# EAGLE design R2P_BLDC_module (EAGLE 6.4)
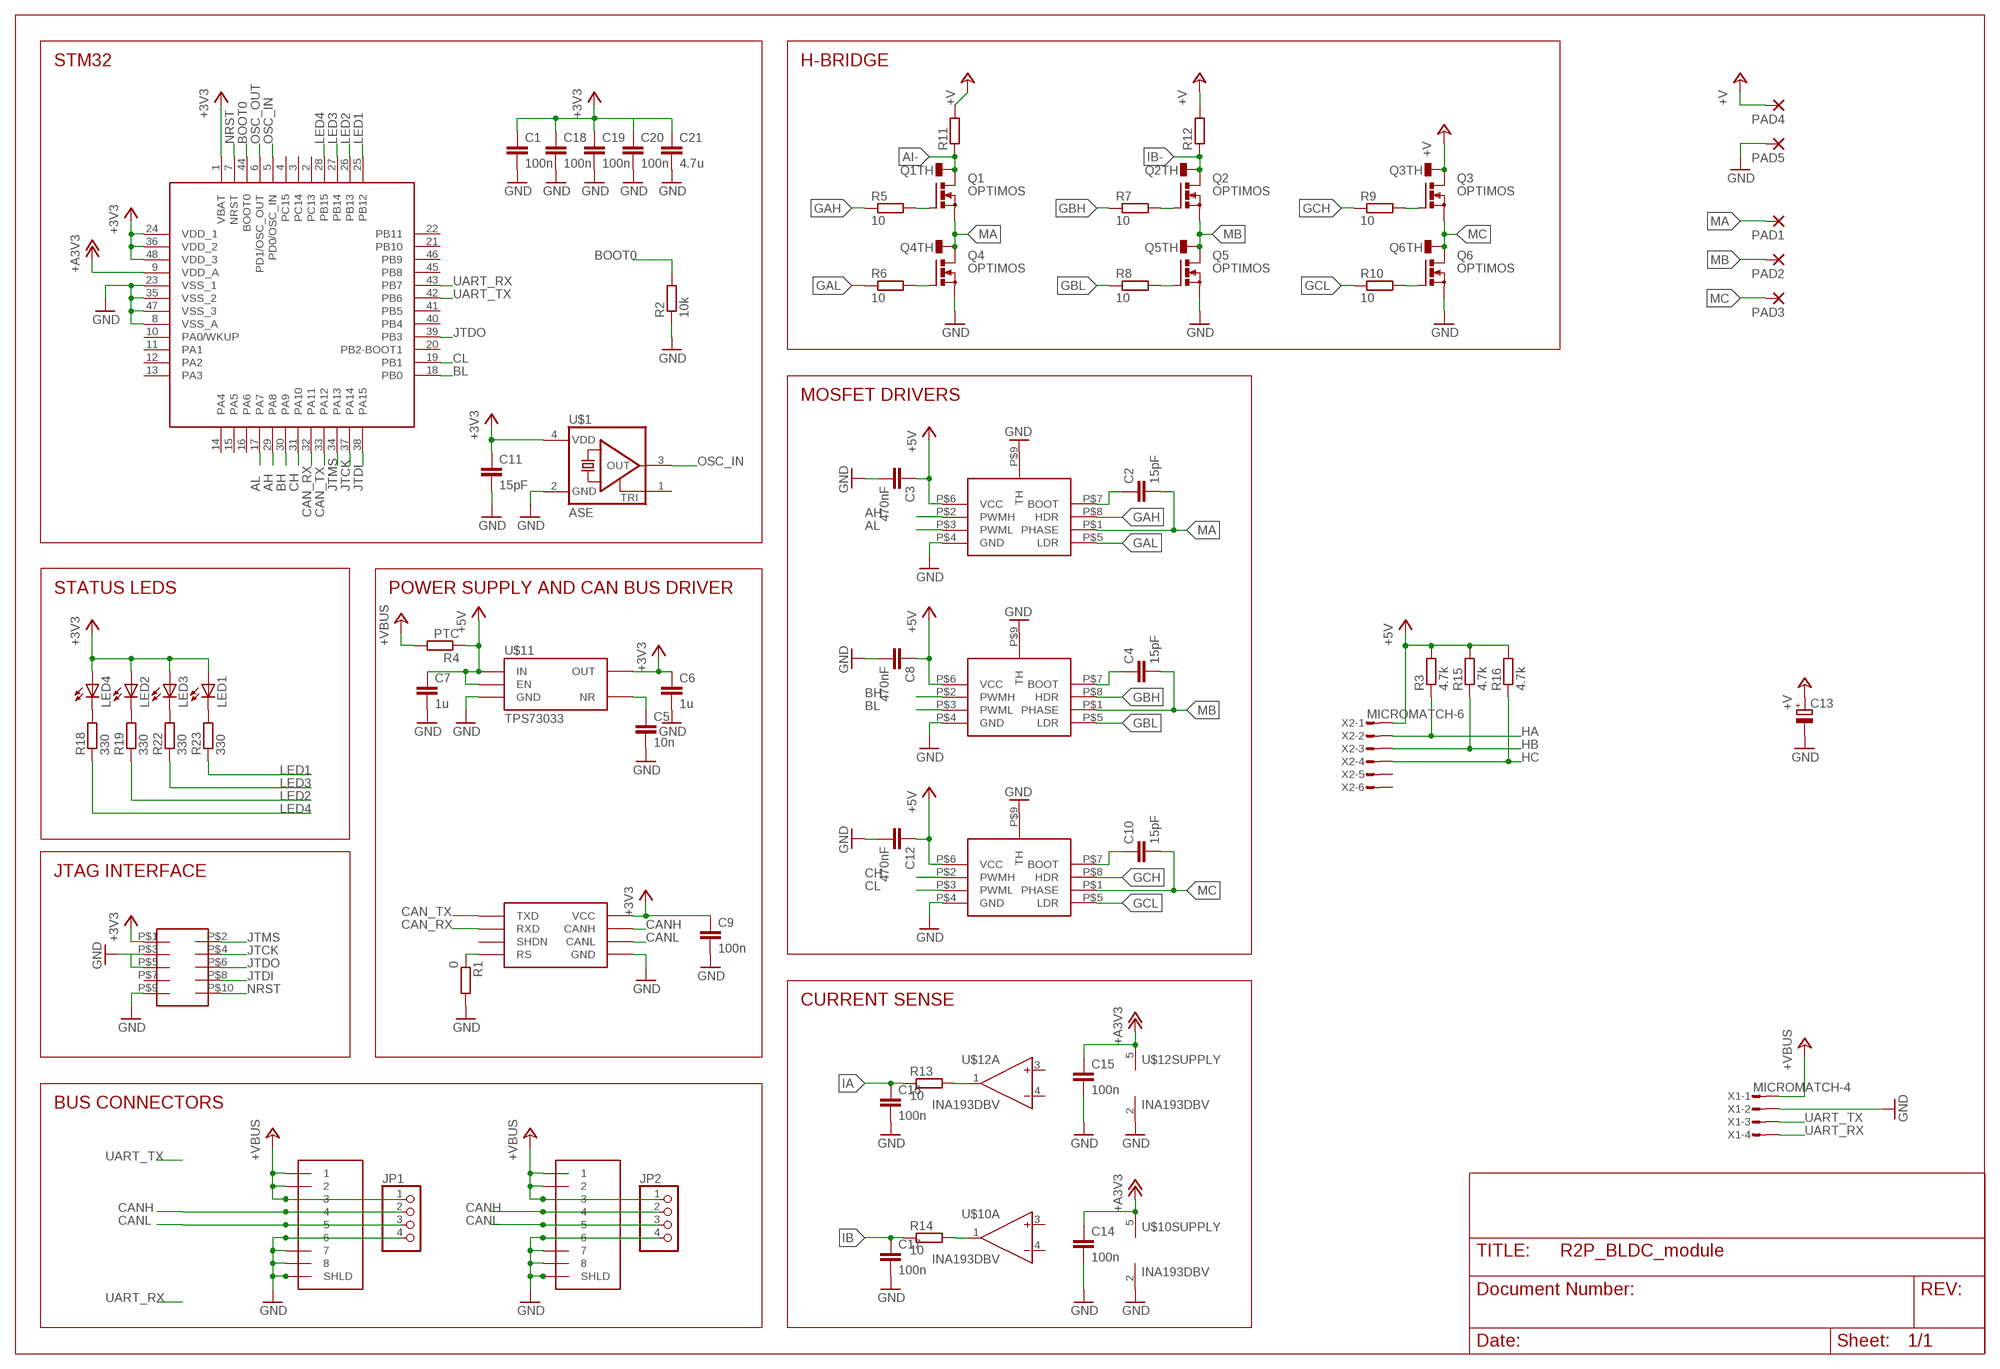
[diagram p0: schematic, sheet 1]

## Parts
1  RJ45-43860  [0438600010]
2  RJ45-43860  [0438600010]
C1  100n  C-EUC0603  [C0603]
C2  15pF  C-EUC0603  [C0603]
C3  470nF  C-EUC0603  [C0603]
C4  15pF  C-EUC0603  [C0603]
C5  10n  C-EUC0603  [C0603]
C6  1u  C-EUC0603  [C0603]
C7  1u  C-EUC0603  [C0603]
C8  470nF  C-EUC0603  [C0603]
C9  100n  C-EUC0603  [C0603]
C10  15pF  C-EUC0603  [C0603]
C11  15pF  C-EUC0603  [C0603]
C12  470nF  C-EUC0603  [C0603]
C13  CPOL-EUE35-12AXIAL  [E35-12]
C14  100n  C-EUC0603  [C0603]
C15  100n  C-EUC0603  [C0603]
C16  100n  C-EUC0603  [C0603]
C17  100n  C-EUC0603  [C0603]
C18  100n  C-EUC0603  [C0603]
C19  100n  C-EUC0603  [C0603]
C20  100n  C-EUC0603  [C0603]
C21  4.7u  C-EUC0805  [C0805]
JP1  PINHD-1X4  [1X04]
JP2  PINHD-1X4  [1X04]
LED1  LEDCHIPLED_0805  [CHIPLED_0805]
LED2  LEDCHIPLED_0805  [CHIPLED_0805]
LED3  LEDCHIPLED_0805  [CHIPLED_0805]
LED4  LEDCHIPLED_0805  [CHIPLED_0805]
PAD1  3,81/1,4  [3,81/1,4]
PAD2  3,81/1,4  [3,81/1,4]
PAD3  3,81/1,4  [3,81/1,4]
PAD4  3,81/1,4  [3,81/1,4]
PAD5  3,81/1,4  [3,81/1,4]
Q1  OPTIMOS  [PG-TDSON-8]
Q2  OPTIMOS  [PG-TDSON-8]
Q3  OPTIMOS  [PG-TDSON-8]
Q4  OPTIMOS  [PG-TDSON-8]
Q5  OPTIMOS  [PG-TDSON-8]
Q6  OPTIMOS  [PG-TDSON-8]
R1  0  R-EU_R0603  [R0603]
R2  10k  R-EU_R0603  [R0603]
R3  4.7k  R-EU_R0603  [R0603]
R4  PTC  R-EU_R0805  [R0805]
R5  10  R-EU_R0603  [R0603]
R6  10  R-EU_R0603  [R0603]
R7  10  R-EU_R0603  [R0603]
R8  10  R-EU_R0603  [R0603]
R9  10  R-EU_R0603  [R0603]
R10  10  R-EU_R0603  [R0603]
R11  R-EU_R1206  [R1206]
R12  R-EU_R1206  [R1206]
R13  10  R-EU_R0603  [R0603]
R14  10  R-EU_R0603  [R0603]
R15  4.7k  R-EU_R0603  [R0603]
R16  4.7k  R-EU_R0603  [R0603]
R18  330  R-EU_R0603  [R0603]
R19  330  R-EU_R0603  [R0603]
R22  330  R-EU_R0603  [R0603]
R23  330  R-EU_R0603  [R0603]
SOT1  MAX3051  [SOT23-8L]
U1  STM32F103CX  [LQFP48]
U$1  ASE  [ASE]
U$2  MCP14700MF  [DFN8]
U$4  FTSH-105  [FTSH-105]
U$8  MCP14700MF  [DFN8]
U$9  MCP14700MF  [DFN8]
U$10  INA193DBV  [SOT23-5L]
U$11  TPS73033  [SOT23-5L]
U$12  INA193DBV  [SOT23-5L]
X1  MICROMATCH-4  [MICROMATCH-4]
X2  MICROMATCH-6  [MICROMATCH-6]

## Nets
+3V3: C1.1 C6.1 C9.1 C11.1 C18.1 C19.1 C20.1 C21.1 LED1.A LED2.A LED3.A LED4.A SOT1.P$3(VCC) U1.1(VBAT) U1.24(VDD_1) U1.36(VDD_2) U1.48(VDD_3) U$1.4(VDD) U$4.P$1 U$11.5(OUT)
+5V: C3.1 C7.1 C8.1 C12.1 R3.2 R4.1 R15.2 R16.2 U$2.P$6(VCC) U$8.P$6(VCC) U$9.P$6(VCC) U$11.1(IN) U$11.3(EN) X2.1
+A3V3: C14.1 C15.1 U1.9(VDD_A) U$10.5(SUPPLY:V+) U$12.5(SUPPLY:V+)
+V: C13.+ PAD4.1(P) Q3.5(D) Q3.6(D) Q3.7(D) Q3.8(D) Q3.TH R11.2 R12.2
+VBUS: 1.P$1 1.P$2 1.P$3 2.P$1 2.P$2 2.P$3 JP1.1 JP2.1 R4.2 X1.1
AH: U1.29(PA8) U$2.P$2(PWMH)
AI-: Q1.5(D) Q1.6(D) Q1.7(D) Q1.8(D) Q1.TH R11.1
AL: U1.17(PA7) U$2.P$3(PWML)
BH: U1.30(PA9) U$8.P$2(PWMH)
BL: U1.18(PB0) U$8.P$3(PWML)
BOOT0: R2.2 U1.44(BOOT0)
CAN_RX: SOT1.P$4(RXD) U1.32(PA11)
CAN_TX: SOT1.P$1(TXD) U1.33(PA12)
CANH: 1.P$4 2.P$4 JP1.2 JP2.2 SOT1.P$7(CANH)
CANL: 1.P$5 2.P$5 JP1.3 JP2.3 SOT1.P$6(CANL)
CH: U1.31(PA10) U$9.P$2(PWMH)
CL: U1.19(PB1) U$9.P$3(PWML)
GAH: R5.1 U$2.P$8(HDR)
GAL: R6.1 U$2.P$5(LDR)
GBH: R7.1 U$8.P$8(HDR)
GBL: R8.1 U$8.P$5(LDR)
GCH: R9.1 U$9.P$8(HDR)
GCL: R10.1 U$9.P$5(LDR)
GND: 1.P$6 1.P$7 1.P$8 1.P$9(SHLD) 1.P$10 2.P$6 2.P$7 2.P$8 2.P$9(SHLD) 2.P$10 C1.2 C3.2 C5.2 C6.2 C7.2 C8.2 C9.2 C11.2 C12.2 C13.- C14.2 C15.2 C16.2 C17.2 C18.2 C19.2 C20.2 C21.2 JP1.4 JP2.4 PAD5.1(P) Q4.1(S) Q4.2(S) Q4.3(S) Q5.1(S) Q5.2(S) Q5.3(S) Q6.1(S) Q6.2(S) Q6.3(S) R1.2 R2.1 SOT1.P$2(GND) U1.8(VSS_A) U1.23(VSS_1) U1.35(VSS_2) U1.47(VSS_3) U$1.2(GND) U$2.P$4(GND) U$2.P$9(TH) U$4.P$3 U$4.P$9 U$8.P$4(GND) U$8.P$9(TH) U$9.P$4(GND) U$9.P$9(TH) U$10.2(SUPPLY:V-) U$11.2(GND) U$12.2(SUPPLY:V-) X1.2
HA: R3.1 X2.2
HB: R15.1 X2.3
HC: R16.1 X2.4
IA: C16.1 R13.1
IB: C17.1 R14.1
IB-: Q2.5(D) Q2.6(D) Q2.7(D) Q2.8(D) Q2.TH R12.1
JTCK: U1.37(PA14) U$4.P$4
JTDI: U1.38(PA15) U$4.P$8
JTDO: U1.39(PB3) U$4.P$6
JTMS: U1.34(PA13) U$4.P$2
LED1: R23.1 U1.25(PB12)
LED2: R19.1 U1.26(PB13)
LED3: R22.1 U1.27(PB14)
LED4: R18.1 U1.28(PB15)
MA: C2.2 PAD1.1(P) Q1.1(S) Q1.2(S) Q1.3(S) Q4.5(D) Q4.6(D) Q4.7(D) Q4.8(D) Q4.TH U$2.P$1(PHASE)
MB: C4.2 PAD2.1(P) Q2.1(S) Q2.2(S) Q2.3(S) Q5.5(D) Q5.6(D) Q5.7(D) Q5.8(D) Q5.TH U$8.P$1(PHASE)
MC: C10.2 PAD3.1(P) Q3.1(S) Q3.2(S) Q3.3(S) Q6.5(D) Q6.6(D) Q6.7(D) Q6.8(D) Q6.TH U$9.P$1(PHASE)
N$1: U$4.P$5
N$2: R1.1 SOT1.P$8(RS)
N$4: C5.1 U$11.4(NR)
N$5: C4.1 U$8.P$7(BOOT)
N$6: C2.1 U$2.P$7(BOOT)
N$7: Q1.4(G) R5.2
N$8: Q4.4(G) R6.2
N$9: Q2.4(G) R7.2
N$10: C10.1 U$9.P$7(BOOT)
N$11: Q5.4(G) R8.2
N$12: Q3.4(G) R9.2
N$13: Q6.4(G) R10.2
N$15: LED4.C R18.2
N$17: R13.2 U$12.1(A:OUT)
N$18: LED2.C R19.2
N$19: R14.2 U$10.1(A:OUT)
N$20: LED3.C R22.2
N$22: LED1.C R23.2
NRST: U1.7(NRST) U$4.P$10
OSC_IN: U1.5(PD0/OSC_IN) U$1.3(OUT)
OSC_OUT: U1.6(PD1/OSC_OUT)
UART_RX: U1.43(PB7) X1.4
UART_TX: U1.42(PB6) X1.3
Unconnected: SOT1.P$5(SHDN) U1.2(PC13) U1.3(PC14) U1.4(PC15) U1.10(PA0/WKUP) U1.11(PA1) U1.12(PA2) U1.13(PA3) U1.14(PA4) U1.15(PA5) U1.16(PA6) U1.20(PB2-BOOT1) U1.21(PB10) U1.22(PB11) U1.40(PB4) U1.41(PB5) U1.45(PB8) U1.46(PB9) U$1.1(TRI) U$4.P$7 U$10.3(A:IN+) U$10.4(A:IN-) U$12.3(A:IN+) U$12.4(A:IN-) X2.5 X2.6

## Notes on the sheet
- STM32 | H-BRIDGE
- MOSFET DRIVERS
- STATUS LEDS | POWER SUPPLY AND CAN BUS DRIVER
- JTAG INTERFACE
- CURRENT SENSE
- BUS CONNECTORS

## Library data of the parts
1 2 = molex:RJ45-43860
C1-C12 C14-C21 = rcl:C-EU: CAPACITOR, European symbol
C13 = rcl:CPOL-EU: POLARIZED CAPACITOR, European symbol
JP1 JP2 = misc:PINHD-1X4: PIN HEADER
LED1-LED4 = led:LED: LED OSRAM: - CHIPLED LG R971, LG N971, LY N971, LG Q971, LY Q971, LO R971, LY R971 LH N974, LH R974 LS Q976, LO Q976, LY Q976 LO Q996 - Hyper CHIPLED LW Q18S LB Q993, LB Q99A, LB R99A - SideLED LS A670, LO A670, LY A670, LG A670, LP A670 LB A673, LV A673, LT A673, LW A673 LH A674 LY A675 LS A676, LA A676, LO A676, LY A676, LW A676 LS A679, LY A679, LG A679 - Hyper Micro SIDELED® LS Y876, LA Y876, LO Y876, LY Y876 LT Y87S - SmartLED LW L88C, LW L88S LB L89C, LB L89S, LG L890 LS L89K, LO L89K, LY L89K LS L896, LA L896, LO L896, LY L896 - TOPLED LS T670, LO T670, LY T670, LG T670, LP T670 LSG T670, LSP T670, LSY T670, LOP T670, LYG T670 LG T671, LOG T671, LSG T671 LB T673, LV T673, LT T673, LW T673 LH T674 LS T676, LA T676, LO T676, LY T676, LB T676, LH T676, LSB T676, LW T676 LB T67C, LV T67C, LT T67C, LS T67K, LO T67K, LY T67K, LW E67C LS E67B, LA E67B, LO E67B, LY E67B, LB E67C, LV E67C, LT E67C LW T67C LS T679, LY T679, LG T679 LS T770, LO T770, LY T770, LG T770, LP T770 LB T773, LV T773, LT T773, LW T773 LH T774 LS E675, LA E675, LY E675, LS T675 LS T776, LA T776, LO T776, LY T776, LB T776 LHGB T686 LT T68C, LB T68C - Hyper Mini TOPLED® LB M676 - Mini TOPLED Santana® LG M470 LS M47K, LO M47K, LY M47K Source: http://www.osram.convergy.de LUXEON: - LUMILED® LXK2-PW12-R00, LXK2-PW12-S00, LXK2-PW14-U00, LXK2-PW14-V00 LXK2-PM12-R00, LXK2-PM12-S00, LXK2-PM14-U00 LXK2-PE12-Q00, LXK2-PE12-R00, LXK2-PE12-S00, LXK2-PE14-T00, LXK2-PE14-U00 LXK2-PB12-K00, LXK2-PB12-L00, LXK2-PB12-M00, LXK2-PB14-N00, LXK2-PB14-P00, LXK2-PB14-Q00 LXK2-PR12-L00, LXK2-PR12-M00, LXK2-PR14-Q00, LXK2-PR14-R00 LXK2-PD12-Q00, LXK2-PD12-R00, LXK2-PD12-S00 LXK2-PH12-R00, LXK2-PH12-S00 LXK2-PL12-P00, LXK2-PL12-Q00, LXK2-PL12-R00 Source: www.luxeon.com KINGBRIGHT: KA-3528ASYC Source: www.kingbright.com
PAD1-PAD5 = wirepad:3,81/1,4: THROUGH-HOLE PAD
Q1-Q6 = infineon:OPTIMOS: OptiMOS TM 3 Power-Transistor BSC340N08NS3 G Source: Data sheet <http://www.infineon.com/dgdl/BSC340N08NS3G_rev2.4.pdf?folderId=db3a304313b8b5a60113cee8763b02d7&fileId=db3a30431add1d95011ae81c21f2563a>
R1-R16 R18 R19 R22 R23 = rcl:R-EU_: RESISTOR, European symbol
SOT1 = maxim:MAX3051
U1 = st:STM32F103CX
U$1 = crystal:ASE: 3.3Vdc CMOS SMD CRYSTAL CLOCK OSCILLATOR SOurce: www.abracon.com; OC_FARNELL: unknown; OC_NEWARK: unknown
U$2 U$8 U$9 = microchip:MCP14700
U$4 = samtec:FTSH-105
U$10 U$12 = texas-instruments:INA193: Current Shunt Monitor -16V to +80V Common-Mode Range
U$11 = texas-instruments:TPS73033
X1 = tyco:MICROMATCH-4: MicroMaTch 4
X2 = apbteam_con-amp-micromatch:MICROMATCH-6: MicroMaTch 6

## Board
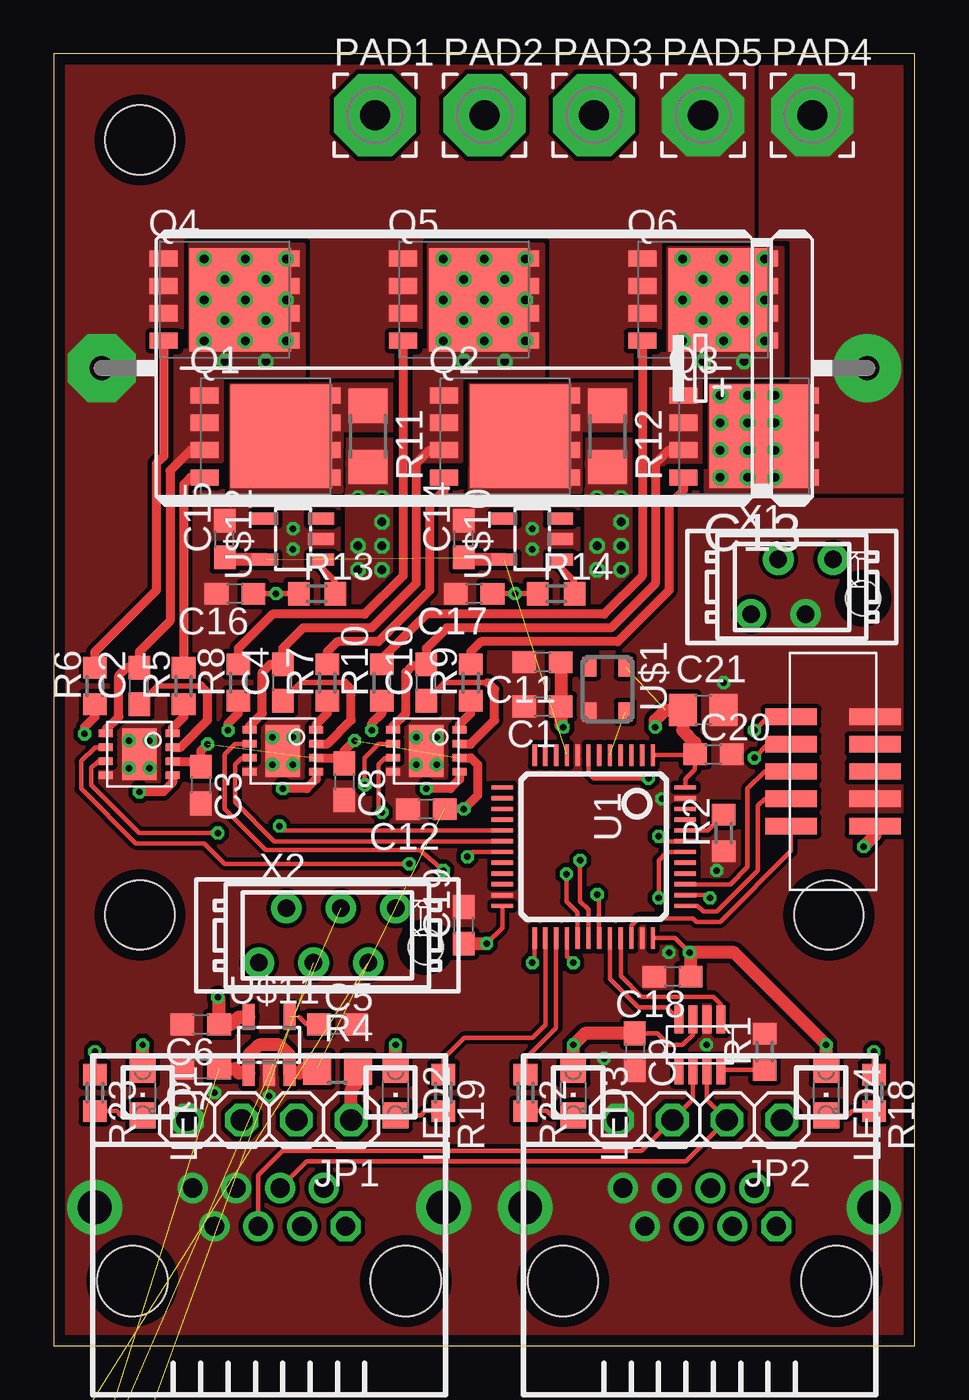
[diagram p1: board, top side]
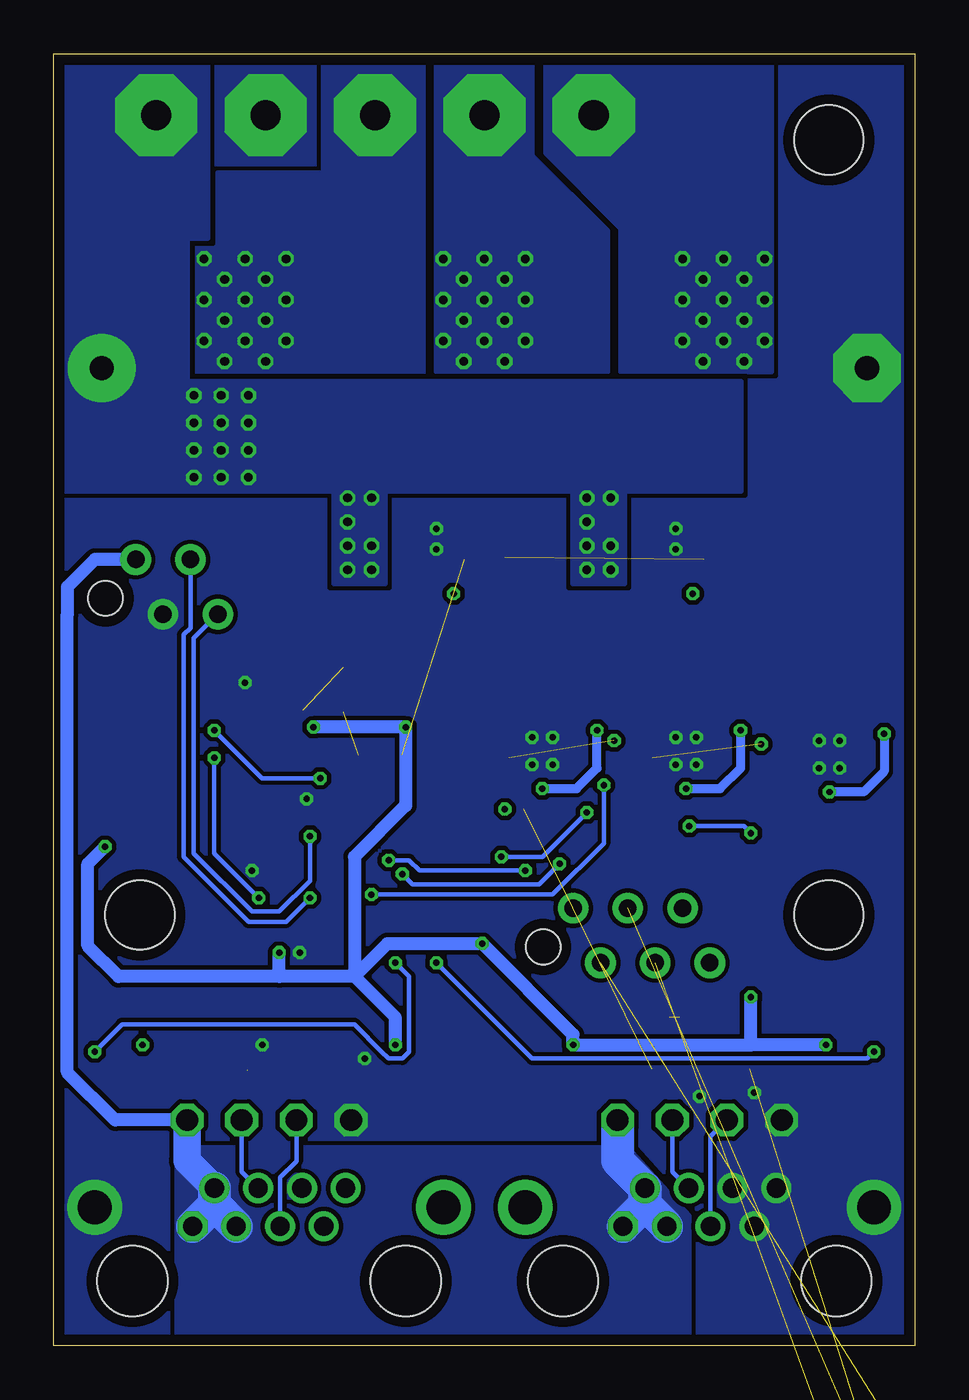
[diagram p2: board, bottom side, seen from below]

Size 40 x 60 mm. Coordinates in mm from the lower left corner, seen from the top.
Outline: 0,0 40,0 40,60 0,60 0,0
Copper layers (1*16): Top 0.035mm / dielectric 1.5mm / Bottom 0.035mm
Design rules "default *": minimum track width 8mil, minimum drill 0.3mm, track to track 8mil, track to pad 8mil, pad to pad 8mil, via to via 8mil, smd to smd 0mil, copper to edge 20mil, drill to drill 10mil, minimum pad ring 10mil, minimum via ring 6mil, stop-mask expansion 2mil, vias tented up to drill 100mil, thermal gap 10mil
Holes 3.2 mm at 4,20 36,20 4,56

### Footprints (pad centres in the part's own frame; a part is rotated, then mirrored left to right if it is on the bottom)
0438600010 = drill 0.889 octagon: P$1 3.556,2.54 | drill 0.889: P$2 2.54,4.318; P$3 1.524,2.54; P$4 0.508,4.318; P$5 -0.508,2.54; P$6 -1.524,4.318; P$7 -2.54,2.54; P$8 -3.556,4.318 | drill 1.575 pad 2.54: P$9 8.103,3.429; P$10 -8.103,3.429 | hole 3.251: -6.35,0; 6.35,0
C0603 = smd 1.1 x 1: 1 -0.85,0; 2 0.85,0
E35-12 = drill 1.118 pad 3.15: + -17.78,0 | drill 1.118 pad 3.15 octagon: - 17.78,0
C0805 = smd 1.3 x 1.5: 1 -0.95,0; 2 0.95,0
1X04 = drill 1.016 octagon: 1 -3.81,0; 2 -1.27,0; 3 1.27,0; 4 3.81,0
CHIPLED_0805 = smd 1.2 x 1.2: A 0,-1.05; C 0,1.05
3,81/1,4 = drill 1.397 pad 3.81 octagon: 1 0,0
PG-TDSON-8 = smd 1.3 x 0.75: 1 -2.825,1.905; 2 -2.825,0.635; 3 -2.825,-0.635; 4 -2.825,-1.905; 5 2.825,-1.905; 6 2.825,-0.635; 7 2.825,0.635; 8 2.825,1.905 | smd 4.7 x 4.8: TH 0.725,0
R0603 = smd 1 x 1.1: 1 -0.85,0; 2 0.85,0
R0805 = smd 1.3 x 1.5: 1 -0.95,0; 2 0.95,0
R1206 = smd 1.6 x 1.803: 1 -1.422,0; 2 1.422,0
SOT23-8L = smd 1.3 x 0.42: P$1 -1.175,1.3; P$2 -1.175,0.65; P$3 -1.175,0; P$4 -1.175,-0.65; P$5 1.175,-0.65; P$6 1.175,0; P$7 1.175,0.65; P$8 1.175,1.3
LQFP48 = smd 1 x 0.2: 1 -4.25,2.75; 2 -4.25,2.25; 3 -4.25,1.75; 4 -4.25,1.25; 5 -4.25,0.75; 6 -4.25,0.25; 7 -4.25,-0.25; 8 -4.25,-0.75; 9 -4.25,-1.25; 10 -4.25,-1.75; 11 -4.25,-2.25; 12 -4.25,-2.75; 25 4.25,-2.75; 26 4.25,-2.25; 27 4.25,-1.75; 28 4.25,-1.25; 29 4.25,-0.75; 30 4.25,-0.25; 31 4.25,0.25; 32 4.25,0.75; 33 4.25,1.25; 34 4.25,1.75; 35 4.25,2.25; 36 4.25,2.75 | smd 0.2 x 1: 13 -2.75,-4.25; 14 -2.25,-4.25; 15 -1.75,-4.25; 16 -1.25,-4.25; 17 -0.75,-4.25; 18 -0.25,-4.25; 19 0.25,-4.25; 20 0.75,-4.25; 21 1.25,-4.25; 22 1.75,-4.25; 23 2.25,-4.25; 24 2.75,-4.25; 37 2.75,4.25; 38 2.25,4.25; 39 1.75,4.25; 40 1.25,4.25; 41 0.75,4.25; 42 0.25,4.25; 43 -0.25,4.25; 44 -0.75,4.25; 45 -1.25,4.25; 46 -1.75,4.25; 47 -2.25,4.25; 48 -2.75,4.25
ASE = smd 0.9 x 0.65: 1 -1.05,-0.825; 2 1.05,-0.825; 3 1.05,0.825; 4 -1.05,0.825
DFN8 = smd 0.65 x 0.35: P$1 -1.55,0.975; P$2 -1.55,0.325; P$3 -1.55,-0.325; P$4 -1.55,-0.975; P$5 1.55,-0.975; P$6 1.55,-0.325; P$7 1.55,0.325; P$8 1.55,0.975 | smd 1.6 x 2.4: P$9 0,0
FTSH-105 = smd 0.76 x 2.4: P$1 -2.54,-1.95; P$2 -2.54,1.95; P$3 -1.27,-1.95; P$4 -1.27,1.95; P$5 0,-1.95; P$6 0,1.95; P$7 1.27,-1.95; P$8 1.27,1.95; P$9 2.54,-1.95; P$10 2.54,1.95
SOT23-5L = smd 0.55 x 1.2: 1 -0.95,-1.3; 2 0,-1.3; 3 0.95,-1.3; 4 0.95,1.3; 5 -0.95,1.3
MICROMATCH-4 = drill 0.813 pad 1.422: 1 1.905,1.27; 2 0.635,-1.27; 3 -0.635,1.27; 4 -1.905,-1.27 | hole 1.6: 3.305,-0.53
MICROMATCH-6 = drill 0.813 pad 1.422: 1 3.175,1.27; 2 1.905,-1.27; 3 0.635,1.27; 4 -0.635,-1.27; 5 -1.905,1.27; 6 -3.175,-1.27 | hole 1.6: 4.575,-0.53

### Placement (x,y rotation side)
1  30,3 0 top
2  10,3 0 top
C1  22.7,29.69 180 top
C2  3.97,30.64 90 top
C3  6.83,26.04 270 top
C4  10.64,30.8 90 top
C5  13.18,14.92 0 top
C6  6.83,14.92 180 top
C7  6.83,12.86 180 top
C8  13.49,26.19 270 top
C9  26.99,13.65 270 top
C10  17.3,30.8 90 top
C11  22.7,31.75 180 top
C12  17.3,24.92 180 top
C13  20,45.4 180 top
C14  19.05,37.47 90 top
C15  7.94,37.47 90 top
C16  8.41,34.92 180 top
C17  19.53,34.92 180 top
C18  28.73,17.14 180 top
C19  19.05,19.53 90 top
C20  30.64,27.46 0 top
C21  30.16,29.53 0 top
JP1  10,10.48 180 top
JP2  30,10.48 180 top
LED1  4.13,11.75 180 top
LED2  15.88,11.75 180 top
LED3  24.13,11.75 180 top
LED4  35.88,11.75 180 top
PAD1  14.92,57.15 0 top
PAD2  20,57.15 0 top
PAD3  25.08,57.15 0 top
PAD4  35.24,57.15 0 top
PAD5  30.16,57.15 0 top
Q1  9.84,42.23 0 top
Q2  20.95,42.23 0 top
Q3  32.07,42.23 0 top
Q4  7.94,48.58 0 top
Q5  19.05,48.58 0 top
Q6  30.16,48.58 0 top
R1  33.02,13.65 90 top
R2  31.11,23.81 90 top
R3  1.27,-4.76 0 top  (outside the outline)
R4  13.18,12.86 0 top
R5  6.03,30.64 90 top
R6  1.91,30.64 90 top
R7  12.7,30.8 90 top
R8  8.57,30.8 90 top
R9  19.37,30.8 90 top
R10  15.24,30.8 90 top
R11  14.61,42.23 270 top
R12  25.72,42.23 270 top
R13  12.22,34.92 0 top
R14  23.34,34.92 0 top
R15  1.27,-9.53 0 top  (outside the outline)
R16  1.27,-14.29 0 top  (outside the outline)
R18  38.1,11.75 270 top
R19  18.1,11.75 270 top
R22  21.91,11.75 270 top
R23  1.91,11.75 270 top
SOT1  29.69,13.97 270 top
U1  25.08,23.18 270 top
U$1  25.72,30.48 270 top
U$2  3.97,27.46 0 top
U$4  36.2,26.67 90 top
U$8  10.64,27.62 0 top
U$9  17.3,27.62 0 top
U$10  22.23,37.47 90 top
U$11  10,13.97 0 top
U$12  11.11,37.47 90 top
X1  34.29,35.24 0 top
X2  12.7,19.05 0 top

### Tracks (layer width: path | path; a pad name or v marks a point on that pad's centre or on a via)
+3V3  (via drill 0.3)  (1 unrouted)
  Top 0.203: C9.1 28.04,14.5 28.57,13.97 29.21,13.97 29.69,14.45 SOT1.P$3 | 8.6,15.27 8.57,15.24 | U1.24 20.83,19.4 v20.11,18.68 | U1.36 28.86,18.93 v29.53,18.26 | U1.48 29.33,26.32 29.79,26.77 C20.1 29.75,27.43 U1.1 | 23.83,28.55 v23.65,28.73
  Top 0.61: 8.57,15.24 8.26,14.92 C6.1 7.68,16.14 v7.62,16.19 | LED1.A v4.13,13.97 | LED2.A v15.88,13.97 | LED3.A v24.13,13.97 24.66,14.5 C9.1 | LED4.A v35.88,13.97 31.59,18.26 v29.53,18.26 29.58,18.26 C18.1 | C19.1 v20.11,18.68 | U$4.P$1 38.15,23.7 v37.62,23.18 | C20.1 29.79,28 29.21,28.57 C21.1 28.42,29.53 27.94,29.05 v27.94,28.73 | 8.6,15.27 U$11.5 | v23.65,28.73 23.55,28.84 C1.1 C11.1
  Bottom 0.61: 7.62,13.97 v7.62,16.19 | v4.13,13.97 7.62,13.97 | 7.62,13.97 v15.88,13.97 15.88,14.45 v20.11,18.68 24.5,18.68 26.04,17.14 | v27.94,28.73 v23.65,28.73 23.65,25.08 26.04,22.7 26.04,17.14 | 26.04,17.14 29.53,17.14 | 29.53,17.14 36.99,17.14 38.42,18.57 38.42,22.38 v37.62,23.18 | 29.53,17.14 v29.53,18.26 | v24.13,13.97 24.13,15.24 26.04,17.14
+5V  (via drill 0.3)  (7 unrouted)
  Top 0.203: 11.4,12.67 11.43,12.7
  Top 0.254: 6.57,27.14 C3.1 | 13.24,27.3 C8.1
  Top 0.406: U$2.P$6 6.57,27.14 | v7.14,27.94 6.83,27.62 C3.1 | U$8.P$6 13.24,27.3 | C8.1 13.49,27.62 v13.97,28.1 | U$9.P$6 19.38,27.3 19.68,26.99 19.68,25.56 v19.05,24.92 C12.1
  Top 0.61: R4.1 11.59,12.86 11.43,12.7 | 11.4,12.67 U$11.3 10.95,13.5 10.48,13.97 9.53,13.97 9.05,13.5 U$11.1 8.6,12.67 8.41,12.86 C7.1
+A3V3  (2 unrouted)
  Top 0.61: U$10.5 19.15,36.52 C14.1 | U$12.5 8.04,36.52 C15.1
+V  (via drill 0.4)
  other vias: 30.96,44.13 32.23,44.13 33.5,44.13 30.96,42.86 32.23,42.86 33.5,42.86 33.5,41.59 32.23,41.59 30.96,41.59 30.96,40.32 32.23,40.32 33.5,40.32 14.13,39.37 15.24,39.37 15.24,38.26 14.13,37.15 15.24,37.15 15.24,36.04 14.13,36.04 26.35,39.37 25.24,39.37 26.35,38.26 26.35,37.15 26.35,36.04 25.24,37.15 25.24,36.04
  pour Top (isolate 0.254, rank 3, no thermals): 32.86,59.37 39.85,59.37 39.85,39.69 30.32,39.69 30.32,45.09 33.97,45.09 33.97,51.44 32.86,51.44
  pour Bottom (isolate 0.254, no thermals): 39.53,39.69 26.99,39.69 26.99,35.4 24.61,35.4 24.61,39.69 15.88,39.69 15.88,35.4 13.49,35.4 13.49,39.69 8.1,39.69 8.1,44.77 33.81,44.77 33.81,51.44 32.86,51.44 32.86,59.53 39.53,59.53
  pour Top (isolate 0.254, rank 3, no thermals): 13.65,42.07 13.65,34.45 14.13,34.45 15.72,36.04 15.72,42.07
  pour Top (isolate 0.254, rank 3, no thermals): 24.77,42.07 24.77,34.45 25.24,34.45 26.83,36.04 26.83,42.07
+VBUS
  Top 0.61: R4.2 14.03,12.12 13.97,12.06 13.81,11.9 JP1.1
  Bottom 0.61: JP2.1 37.15,10.48 39.37,12.7 39.37,33.97 39.37,35.24 38.1,36.51 X1.1
  Bottom 1.27: JP2.1 33.81,8.59 1.P$2
  Bottom 1.524: JP1.1 13.81,8.59 2.P$2 | 2.P$2 12.54,6.56 | 12.54,6.56 2.P$1 | 2.P$3 12.54,6.56 | 12.54,6.56 2.P$2 | 1.P$1 32.54,6.56 | 32.54,6.56 1.P$2 32.54,6.56 | 1.P$3 32.54,6.56
  pour Bottom (no thermals): 10.48,0 10.48,6.03 13.34,9.21 34.29,9.21 34.29,0
AH  (via drill 0.3)
  Top 0.203: U$2.P$2 1.91,27.79 1.27,27.15 1.27,25.88 3.81,23.34 6.99,23.34 7.94,22.38 v16.51,22.38 | v23.81,21.91 23.81,20.64 24.33,20.12 U1.29
  Bottom 0.203: v16.51,22.38 17.46,21.43 23.34,21.43 v23.81,21.91
AI-
  pour Top (isolate 0.254, rank 3, no thermals): 8.26,44.61 8.26,39.69 13.34,39.69 13.34,42.55 15.72,42.55 15.72,44.61
AL  (via drill 0.3)
  Top 0.203: U$2.P$3 2.06,27.14 1.75,26.83 1.75,26.04 3.97,23.81 v7.62,23.81 | U1.17 10.68,23.93 v10.48,24.13
  Bottom 0.203: v10.48,24.13 7.94,24.13 v7.62,23.81
BH  (via drill 0.3)
  Top 0.203: U$8.P$2 8.42,27.95 7.94,27.46 7.94,24.92 9.84,23.02 16.99,23.02 v18.1,22.07 | v24.45,22.54 24.45,20.64 24.83,20.25 U1.30
  Bottom 0.203: v18.1,22.07 23.02,22.07 23.5,22.54 v24.45,22.54
BL
  Top 0.203: U$8.P$3 8.72,27.3 8.41,26.99 8.41,25.24 10.23,23.43 U1.18
BOOT0
  Top 0.203: U1.44 30.38,23.93 R2.2
CAN_RX
  Top 0.203: U1.32 25.83,17.03 27.15,15.72 28.46,15.72 SOT1.P$4
CAN_TX
  Top 0.203: U1.33 26.33,17.16 27.3,16.19 30.64,16.19 30.99,15.85 SOT1.P$1
CANH
  Top 0.203: 2.P$4 10.51,7.33 11.75,8.57 29.37,8.57 JP2.2 30.34,11.41 SOT1.P$7
  Bottom 0.203: JP1.2 11.27,8.08 2.P$4 | JP2.2 31.27,8.08 1.P$4
CANL
  Top 0.203: 2.P$5 9.49,7.9 10.64,9.05 27.3,9.05 JP2.3 29.69,11.43 SOT1.P$6
  Bottom 0.203: 1.P$5 29.49,7.81 28.73,8.57 JP2.3 | 2.P$5 9.49,9.72 JP1.3
CH  (via drill 0.3)
  Top 0.203: U$9.P$2 15.09,27.95 14.45,27.3 v14.45,26.04 | U1.31 25.33,20.86 v25.24,20.95
  Bottom 0.203: v14.45,26.04 14.45,23.34 16.83,20.95 v25.24,20.95
CL  (via drill 0.3)
  Top 0.203: U$9.P$3 15.39,27.3 15.08,26.99 15.08,24.92 v15.24,24.77 | v19.21,22.7 19.43,22.93 U1.19
  Bottom 0.203: v15.24,24.77 17.3,22.7 v19.21,22.7
GAH
  Top 0.406: U$2.P$8 5.52,28.7 6.03,29.21 R5.1
GAL  (via drill 0.3)
  Top 0.406: v1.43,28.42 1.43,28.73 1.91,29.21 R6.1 | U$2.P$5 5.52,26.16 5.08,25.72 v3.97,25.72
  Bottom 0.406: v1.43,28.42 1.43,26.67 2.38,25.72 v3.97,25.72
GBH
  Top 0.406: U$8.P$8 12.19,28.86 12.7,29.37 R7.1
GBL  (via drill 0.3)
  Top 0.406: v8.1,28.57 8.1,28.89 8.57,29.37 R8.1 | U$8.P$5 12.19,26.32 11.75,25.88 v10.64,25.88
  Bottom 0.406: v10.64,25.88 9.05,25.88 8.1,26.83 v8.1,28.57
GCH
  Top 0.406: U$9.P$8 18.85,28.86 19.37,29.37 R9.1
GCL  (via drill 0.3)
  Top 0.406: U$9.P$5 18.85,26.32 18.41,25.88 v17.3,25.88 | R10.1 15.24,29.37 14.76,28.89 v14.76,28.57
  Bottom 0.406: v17.3,25.88 15.72,25.88 14.76,26.83 v14.76,28.57
GND  (via drill 0.3)
  other vias: 30.8,22.07 30.32,13.97 10,11.59 7.46,11.75 31.11,30.8 28.57,18.26 28.26,25.4 25.56,13.34 11.11,37.94 11.11,36.99 22.23,37.94 22.23,36.99 16.83,28.26 17.78,28.26 17.78,26.99 16.83,26.99 10.16,28.26 11.11,28.26 11.11,26.99 10.16,26.99 3.49,28.1 4.45,28.1 4.45,26.83 3.49,26.83
  pour Bottom (rank 6, no thermals): 0,0 40,0 40,60 0,60
  pour Top (rank 6, no thermals): 0,0 40,0 40,60 0,60
HA  (1 unrouted)
HB  (1 unrouted)
HC  (1 unrouted)
IA  (via drill 0.3)
  Top 0.254: C16.1 v10.32,34.92 R13.1
IB  (via drill 0.3)
  Top 0.254: R14.1 v21.43,34.92 C17.1
IB-
  pour Top (isolate 0.254, rank 3, no thermals): 19.37,44.61 19.37,39.69 24.45,39.69 24.45,42.55 26.83,42.55 26.83,44.61
JTCK
  Top 0.203: U1.37 29.9,20.43 30.16,20.16 30.8,20.16 32.7,22.07 32.7,25.08 33.02,25.4 33.18,25.4 U$4.P$4
JTDI  (via drill 0.3)
  Top 0.203: U$4.P$8 33.18,27.94 v32.54,27.3 | U1.38 30.35,20.93 v30.48,20.8
  Bottom 0.203: v32.54,27.3 32.54,22.86 v30.48,20.8
JTDO
  Top 0.203: U$4.P$6 33.02,26.67 32.23,25.88 32.23,22.23 31.43,21.43 U1.39
JTMS
  Top 0.203: U1.34 26.83,19.53 27.15,19.84 29.69,19.84 29.84,19.68 30.96,19.68 34.24,22.97 U$4.P$2
LED1  (via drill 0.3)
  Top 0.203: U1.25 22.33,17.89 v22.23,17.78 | R23.1 v1.91,13.65
  Bottom 0.203: v22.23,17.78 17.78,13.34 2.54,13.34 2.22,13.34 v1.91,13.65
LED2
  Top 0.203: U1.26 22.83,14.89 22.23,14.29 19.05,14.29 18.1,13.34 R19.1
LED3
  Top 0.203: U1.27 23.33,14.76 21.91,13.34 R22.1
LED4  (via drill 0.3)
  Top 0.203: U1.28 23.83,18.08 v24.13,17.78 | R18.1 v38.1,13.65
  Bottom 0.203: v24.13,17.78 23.5,17.14 23.5,13.97 23.5,13.65 23.81,13.34 24.45,13.34 24.77,13.65 26.04,14.92 36.83,14.92 v38.1,13.65
MA  (via drill 0.4)
  Top 0.406: Q1.3 6.35,41.59 5.4,40.64 5.4,33.66 3.97,32.23 C2.2 3.39,31.49 3.02,31.11 3.02,29.21 2.42,28.61 U$2.P$1
  other vias: 6.99,50.48 8.89,50.48 10.79,50.48 10.79,48.58 8.89,48.58 6.99,48.58 6.99,46.67 8.89,46.67 10.79,46.67 9.84,47.62 9.84,49.53 7.94,49.53 7.94,47.62 7.94,45.72 9.84,45.72
  pour Top (isolate 0.254, rank 2, no thermals): 6.35,51.12 11.59,51.12 11.59,45.09 7.78,45.09 7.78,41.12 5.56,41.12 5.56,46.2 6.35,46.2
  pour Bottom (isolate 0.254, rank 3, no thermals): 17.14,59.53 17.14,55.4 13.65,51.91 13.65,45.24 6.67,45.24 6.67,59.53
MB  (via drill 0.4)
  Top 0.406: Q2.3 17.46,41.59 16.83,40.96 16.83,35.4 14.76,33.34 11.59,33.34 10.64,32.38 C4.2 10.06,31.65 9.68,31.27 9.68,29.37 9.09,28.77 U$8.P$1
  other vias: 21.91,50.48 20,50.48 18.1,50.48 21.91,48.58 20,48.58 18.1,48.58 19.05,49.53 20.95,49.53 19.05,47.62 20.95,47.62 21.91,46.67 20,46.67 18.1,46.67 20.95,45.72 19.05,45.72
  pour Top (isolate 0.254, rank 2, no thermals): 17.46,51.12 22.7,51.12 22.7,45.09 18.89,45.09 18.89,41.12 16.67,41.12 16.67,46.2 17.46,46.2
  pour Bottom (isolate 0.254, rank 3, no thermals): 22.23,59.53 22.23,45.24 14.29,45.24 14.29,51.75 17.78,55.24 17.78,59.53
MC  (via drill 0.4)
  Top 0.406: Q3.3 28.57,41.59 27.94,40.96 27.94,35.4 25.88,33.34 18.26,33.34 17.3,32.38 C10.2 17.25,31.59 16.67,31.59 16.35,31.27 16.35,29.37 15.75,28.77 U$9.P$1
  other vias: 29.21,50.48 31.11,50.48 33.02,50.48 32.07,49.53 30.16,49.53 29.21,48.58 31.11,48.58 33.02,48.58 32.07,47.62 30.16,47.62 29.21,46.67 31.11,46.67 33.02,46.67 32.07,45.72 30.16,45.72
  pour Top (isolate 0.254, rank 2, no thermals): 28.57,50.96 33.81,50.96 33.81,45.09 30,45.09 30,40.96 27.78,40.96 27.78,46.04 28.57,46.04
  pour Bottom (isolate 0.254, rank 3, no thermals): 22.86,59.53 27.46,59.53 27.46,54.45 32.38,54.45 32.38,51.12 33.5,51.12 33.5,45.09 22.86,45.09
N$2  (1 unrouted)
  Top 0.203: R1.1 30.99,12.8
N$4  (1 unrouted)
  Top 0.203: C5.1 11.75,14.92 11.4,15.27
N$5
  Top 0.254: C4.1 11.49,30.8 13.49,30.8
  Top 0.406: U$8.P$7 12.71,27.95 13.81,29.05 13.81,30.48 13.49,30.8
N$6
  Top 0.254: 6.83,30.64 4.82,30.64 C2.1
  Top 0.406: U$2.P$7 5.88,27.79 7.14,29.05 7.14,30.32 6.83,30.64
N$7
  Top 0.406: Q1.4 6.35,40.32 6.03,40.01 R5.2
N$8
  Top 0.406: Q4.4 5.11,41.31 4.76,40.96 4.76,35.08 1.91,32.23 R6.2
N$9
  Top 0.406: R7.2 12.7,32.23 13.18,32.7 15.08,32.7 17.46,35.08 17.46,39.05 18.13,39.72 Q2.4
N$10
  Top 0.254: 20.16,30.8 18.15,30.8 C10.1
  Top 0.406: U$9.P$7 19.36,27.95 19.37,27.94 20.48,29.05 20.48,30.48 20.16,30.8
N$11
  Top 0.406: Q5.4 16.23,35.75 14.45,33.97 10.16,33.97 8.57,32.38 R8.2
N$12
  Top 0.406: Q3.4 29.24,39.72 28.57,39.05 28.57,35.08 26.19,32.7 19.84,32.7 19.37,32.23 R9.2
N$13
  Top 0.406: R10.2 15.24,31.91 17.3,33.97 25.56,33.97 27.34,35.75 Q6.4
N$15
  Top 0.203: LED4.C 36.89,10.7 37.09,10.9 R18.2
N$17
  Top 0.254: U$12.1 12.41,36.16 13.07,35.5 R13.2
N$18
  Top 0.203: LED2.C 17.05,10.7 17.25,10.9 R19.2
N$19
  Top 0.254: U$10.1 23.52,36.16 24.19,35.5 R14.2
N$20
  Top 0.203: R22.2 22.92,10.9 23.12,10.7 LED3.C
N$22
  Top 0.203: LED1.C 3.11,10.7 2.91,10.9 R23.2
NRST  (via drill 0.3)
  Top 0.203: U$4.P$10 33.18,29.21 v32.54,28.57 | v27.62,26.35 25.08,26.35 24.83,26.6 U1.7
  Bottom 0.203: v27.62,26.35 30.32,26.35 v32.54,28.57
OSC_IN  (1 unrouted)
UART_RX  (via drill 0.3)
  Top 0.203: U1.43 28.35,23.43 v28.1,23.65
  Bottom 0.203: v28.1,23.65 28.1,21.59 29.53,20.16 30.8,20.16 33.5,22.86 33.5,32.86 X1.4
UART_TX  (via drill 0.3)
  Top 0.203: U1.42 28.48,22.93 28.1,22.54 v28.1,20.8
  Bottom 0.203: v28.1,20.8 29.21,19.68 30.96,19.68 33.97,22.7 33.97,33.02 33.66,33.34 X1.3